# EAGLE schematic basePCB (EAGLE 7.3.0)
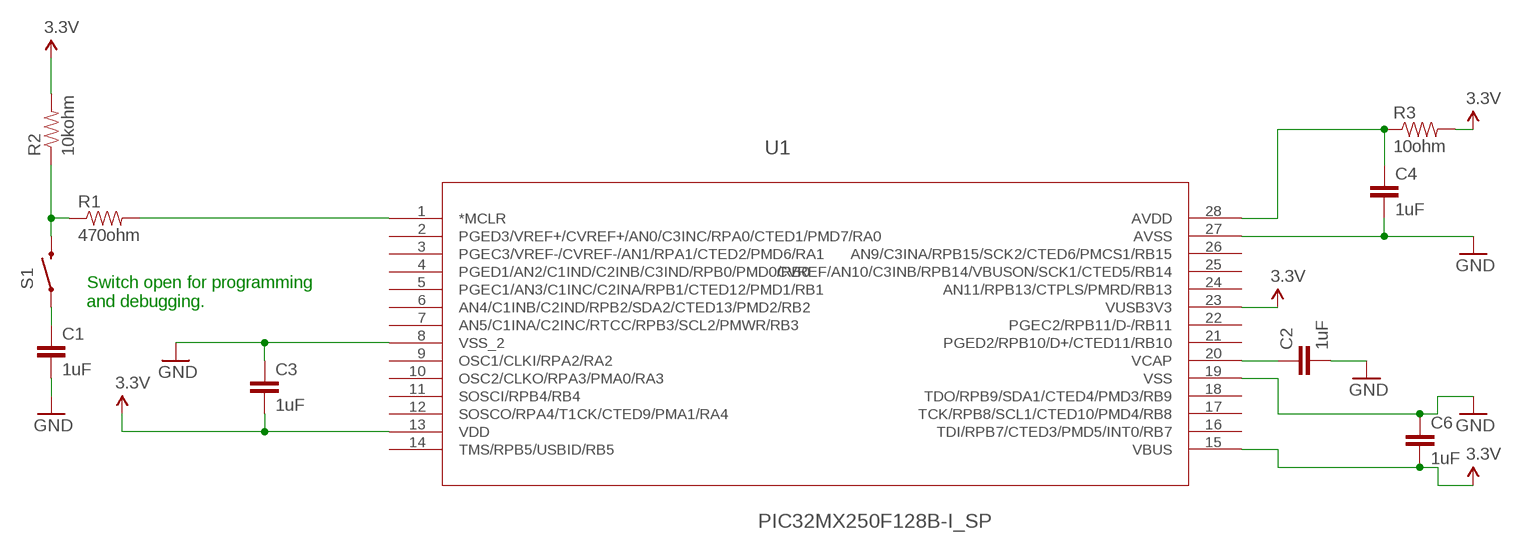
[diagram p0: schematic, sheet 1]

## Parts
C1  1uF  CAPPTH  [CAP-PTH-SMALL]
C2  1uF  CAPPTH  [CAP-PTH-SMALL]
C3  1uF  CAPPTH  [CAP-PTH-SMALL]
C4  1uF  CAPPTH  [CAP-PTH-SMALL]
C6  1uF  CAPPTH  [CAP-PTH-SMALL]
R1  470ohm  RESISTORPTH-1/4W  [AXIAL-0.4]
R2  10kohm  RESISTORPTH-1/4W  [AXIAL-0.4]
R3  10ohm  RESISTORPTH-1/4W  [AXIAL-0.4]
S1  SWITCH-MOMENTARY-2SMD-1101NE  [TACTILE-SWITCH-1101NE]
U1  PIC32MX250F128B-I_SP  [SPDIP28_300MC]

## Nets
GND [supply]: C1.2 C2.2 C3.1 C4.2 C6.1 U1.8(VSS_2) U1.19(VSS) U1.27(AVSS)
N$1 [supply]: R1.P$2 U1.1(*MCLR)
N$2 [supply]: R1.P$1 R2.P$1 S1.2
N$3 [supply]: C1.1 S1.1
N$4 [supply]: C4.1 R3.P$1 U1.28(AVDD)
N$5 [supply]: C2.1 U1.20(VCAP)
VCC [supply]: C3.2 C6.2 R2.P$2 R3.P$2 U1.13(VDD) U1.15(VBUS) U1.23(VUSB3V3) ; supply symbol labelled 3.3V
Unconnected: U1.2(PGED3/VREF+/CVREF+/AN0/C3INC/RPA0/CTED1/PMD7/RA0) U1.3(PGEC3/VREF-/CVREF-/AN1/RPA1/CTED2/PMD6/RA1) U1.4(PGED1/AN2/C1IND/C2INB/C3IND/RPB0/PMD0/RB0) U1.5(PGEC1/AN3/C1INC/C2INA/RPB1/CTED12/PMD1/RB1) U1.6(AN4/C1INB/C2IND/RPB2/SDA2/CTED13/PMD2/RB2) U1.7(AN5/C1INA/C2INC/RTCC/RPB3/SCL2/PMWR/RB3) U1.9(OSC1/CLKI/RPA2/RA2) U1.10(OSC2/CLKO/RPA3/PMA0/RA3) U1.11(SOSCI/RPB4/RB4) U1.12(SOSCO/RPA4/T1CK/CTED9/PMA1/RA4) U1.14(TMS/RPB5/USBID/RB5) U1.16(TDI/RPB7/CTED3/PMD5/INT0/RB7) U1.17(TCK/RPB8/SCL1/CTED10/PMD4/RB8) U1.18(TDO/RPB9/SDA1/CTED4/PMD3/RB9) U1.21(PGED2/RPB10/D+/CTED11/RB10) U1.22(PGEC2/RPB11/D-/RB11) U1.24(AN11/RPB13/CTPLS/PMRD/RB13) U1.25(CVREF/AN10/C3INB/RPB14/VBUSON/SCK1/CTED5/RB14) U1.26(AN9/C3INA/RPB15/SCK2/CTED6/PMCS1/RB15)

## Notes on the sheet
- Switch open for programming
  and debugging.

## Library data of the parts
C1-C4 C6 = SparkFun-Capacitors:CAP: Capacitor Standard 0603 ceramic capacitor, and 0.1" leaded capacitor.
R1-R3 = SparkFun-Passives:RESISTOR: Resistor Basic schematic elements and footprints for 0603, 1206, and PTH resistors.
S1 = SparkFun-Electromechanical:SWITCH-MOMENTARY-2: Various NO switches- pushbuttons, reed, etc; PROD_ID: SWCH-00815
U1 = PIC32MX:PIC32MX250F128B-I_SP

## Net classes
0 default: width 0.254 mm, clearance 0.254 mm
1 supply: width 0.508 mm, clearance 0.508 mm